# EAGLE schematic PCB2 (EAGLE 9.6.2)
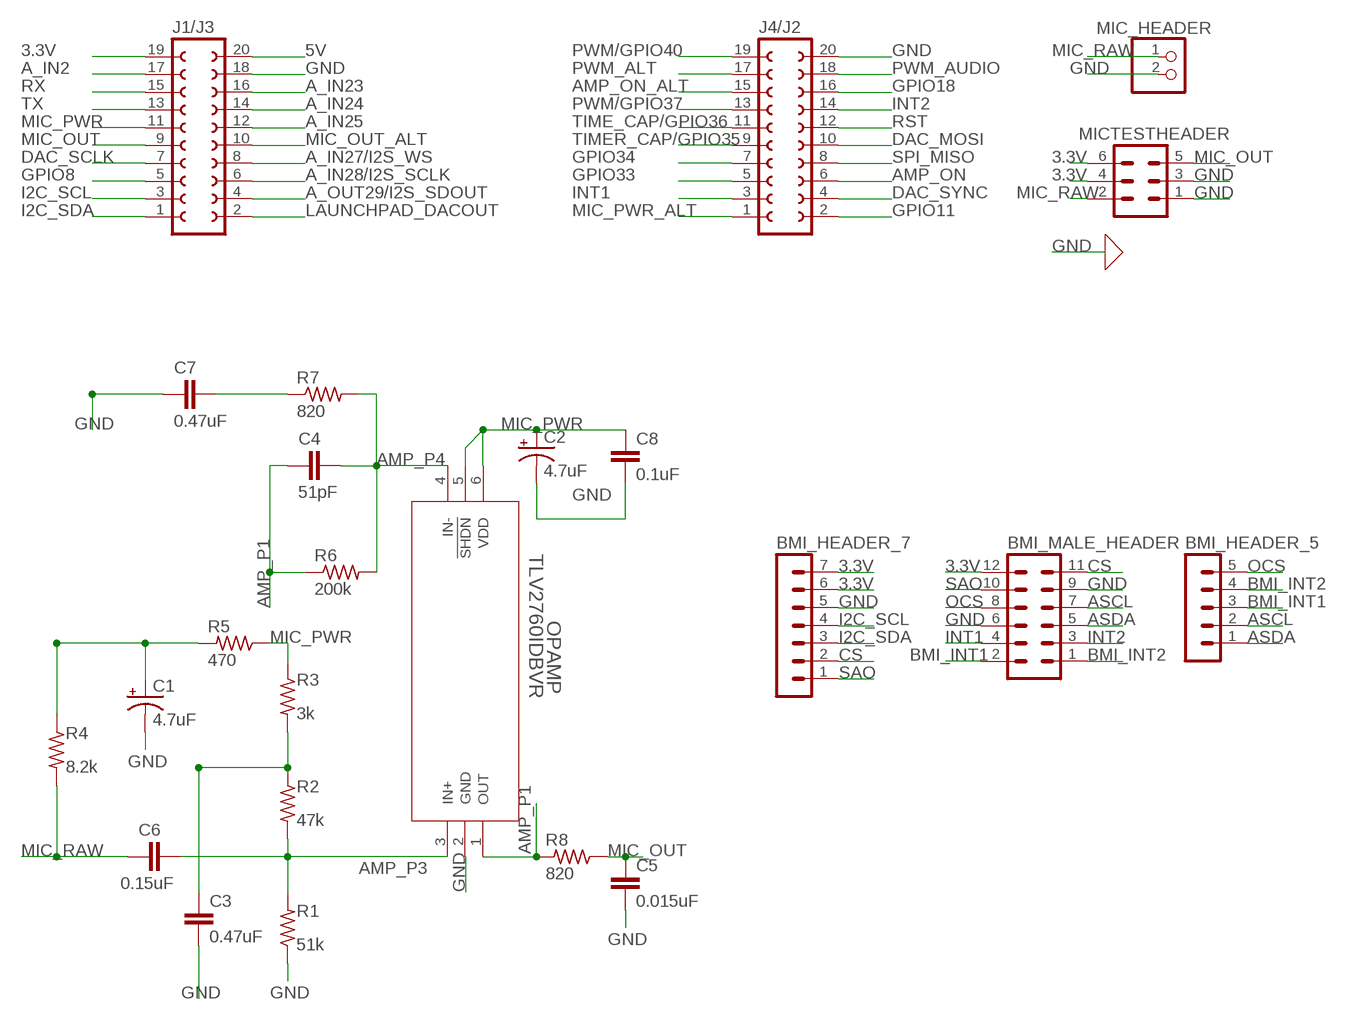
[diagram p0: schematic, sheet 1]

## Parts
BMI_HEADER_5  MA05-1  [MA05-1]
BMI_HEADER_7  MA07-1  [MA07-1]
BMI_MALE_HEADER  MA06-2  [MA06-2]
C1  4.7uF  CPOL-USB/3528-21W  [B/3528-21W]
C2  4.7uF  CPOL-USB/3528-21W  [B/3528-21W]
C3  0.47uF  C-EUC0603  [C0603]
C4  51pF  C-EUC0603  [C0603]
C5  0.015uF  C-EUC0603  [C0603]
C6  0.15uF  C-EUC0603  [C0603]
C7  0.47uF  C-EUC0603  [C0603]
C8  0.1uF  C-EUC0603  [C0603]
J1/J3  FE10-2W  [FE10-2W]
J4/J2  FE10-2W  [FE10-2W]
MIC_HEADER  PINHD-1X2  [1X02]
MICTESTHEADER  MA03-2  [MA03-2]
OPAMP  TLV2760IDBVR  [DBV6]
R1  51k  R-US_MELF0204R  [MINI_MELF-0204R]
R2  47k  R-US_MELF0204R  [MINI_MELF-0204R]
R3  3k  R-US_MELF0204R  [MINI_MELF-0204R]
R4  8.2k  R-US_MELF0204R  [MINI_MELF-0204R]
R5  470  R-US_MELF0204R  [MINI_MELF-0204R]
R6  200k  R-US_MELF0204R  [MINI_MELF-0204R]
R7  820  R-US_MELF0204R  [MINI_MELF-0204R]
R8  820  R-US_MELF0204R  [MINI_MELF-0204R]

## Nets
3.3V: BMI_HEADER_7.6 BMI_HEADER_7.7 BMI_MALE_HEADER.12 J1/J3.19 MICTESTHEADER.4 MICTESTHEADER.6
5V: J1/J3.20
A_IN2: J1/J3.17
A_IN23: J1/J3.16
A_IN24: J1/J3.14
A_IN25: J1/J3.12
A_IN27/I2S_WS: J1/J3.8
A_IN28/I2S_SCLK: J1/J3.6
A_OUT29/I2S_SDOUT: J1/J3.4
AMP_ON: J4/J2.6
AMP_ON_ALT: J4/J2.15
AMP_P1: C4.2 OPAMP.1(OUT) R6.1 R8.2
AMP_P3: C6.2 OPAMP.3(IN+) R1.2 R2.2
AMP_P4: C4.1 OPAMP.4(IN-) R6.2 R7.2
ASCL: BMI_HEADER_5.2 BMI_MALE_HEADER.7
ASDA: BMI_HEADER_5.1 BMI_MALE_HEADER.5
BMI_INT1: BMI_HEADER_5.3 BMI_MALE_HEADER.2
BMI_INT2: BMI_HEADER_5.4 BMI_MALE_HEADER.1
CS: BMI_HEADER_7.2 BMI_MALE_HEADER.11
DAC_MOSI: J4/J2.10
DAC_SCLK: J1/J3.7
DAC_SYNC: J4/J2.4
GND: BMI_HEADER_7.5 BMI_MALE_HEADER.6 BMI_MALE_HEADER.9 C1.- C2.- C3.2 C5.2 C7.2 C8.2 J1/J3.18 J4/J2.20 MIC_HEADER.2 MICTESTHEADER.1 MICTESTHEADER.3 OPAMP.2(GND) R1.1
GPIO8: J1/J3.5
GPIO11: J4/J2.2
GPIO18: J4/J2.16
GPIO33: J4/J2.5
GPIO34: J4/J2.7
I2C_SCL: BMI_HEADER_7.4 J1/J3.3
I2C_SDA: BMI_HEADER_7.3 J1/J3.1
INT1: BMI_MALE_HEADER.4 J4/J2.3
INT2: BMI_MALE_HEADER.3 J4/J2.14
LAUNCHPAD_DACOUT: J1/J3.2
MIC_OUT: C5.1 J1/J3.9 MICTESTHEADER.5 R8.1
MIC_OUT_ALT: J1/J3.10
MIC_PWR: C2.+ C8.1 J1/J3.11 OPAMP.5(!SHDN) OPAMP.6(VDD) R3.1 R5.1
MIC_PWR_ALT: J4/J2.1
MIC_RAW: C6.1 MIC_HEADER.1 MICTESTHEADER.2 R4.2
N$1: C3.1 R2.1 R3.2
N$4: C1.+ R4.1 R5.2
N$6: C7.1 R7.1
OCS: BMI_HEADER_5.5 BMI_MALE_HEADER.8
PWM/GPIO37: J4/J2.13
PWM/GPIO40: J4/J2.19
PWM_ALT: J4/J2.17
PWM_AUDIO: J4/J2.18
RST: J4/J2.12
RX: J1/J3.15
SAO: BMI_HEADER_7.1 BMI_MALE_HEADER.10
SPI_MISO: J4/J2.8
TIME_CAP/GPIO36: J4/J2.11
TIMER_CAP/GPIO35: J4/J2.9
TX: J1/J3.13

## Library data of the parts
BMI_HEADER_5 = con-lstb:MA05-1: PIN HEADER; OC_FARNELL: unknown; OC_NEWARK: unknown
BMI_HEADER_7 = con-lstb:MA07-1: PIN HEADER; OC_FARNELL: unknown; OC_NEWARK: unknown
BMI_MALE_HEADER = con-lstb:MA06-2: PIN HEADER; OC_FARNELL: unknown; OC_NEWARK: unknown
C1 C2 = rcl:CPOL-US: POLARIZED CAPACITOR, American symbol; SPICEPREFIX: C
C3-C8 = rcl:C-EU: CAPACITOR, European symbol; SPICEPREFIX: C
J1/J3 J4/J2 = con-lsta:FE10-2W: FEMALE HEADER; OC_FARNELL: unknown; OC_NEWARK: unknown
MIC_HEADER = pinhead:PINHD-1X2: PIN HEADER
MICTESTHEADER = con-lstb:MA03-2: PIN HEADER; OC_FARNELL: unknown; OC_NEWARK: unknown
OPAMP = TLV2760IDBVR:TLV2760IDBVR; DATASHEET_URL: http://www.ti.com/lit/gpn/TLV2760; DESCRIPTION: Single 1.8-V, Micro-power, Rail-to-Rail, Single Supply Amplifier with Shutdown; FAMILY_NAME: LOW POWER; GENERIC_PART_NUMBER: TLV2760; INDUSTRY_STD_PKG_TYPE: SOT-23; MANUFACTURER: Texas Instruments; MANUFACTURER_PART_NUMBER: TLV2760IDBVR; PACKAGE_DESIGNATOR: DBV; PIN_COUNT: 6; VENDOR: Texas Instruments
R1-R8 = adafruit:R-US_: RESISTOR, American symbol

## Net classes
0 default: width 0.203 mm